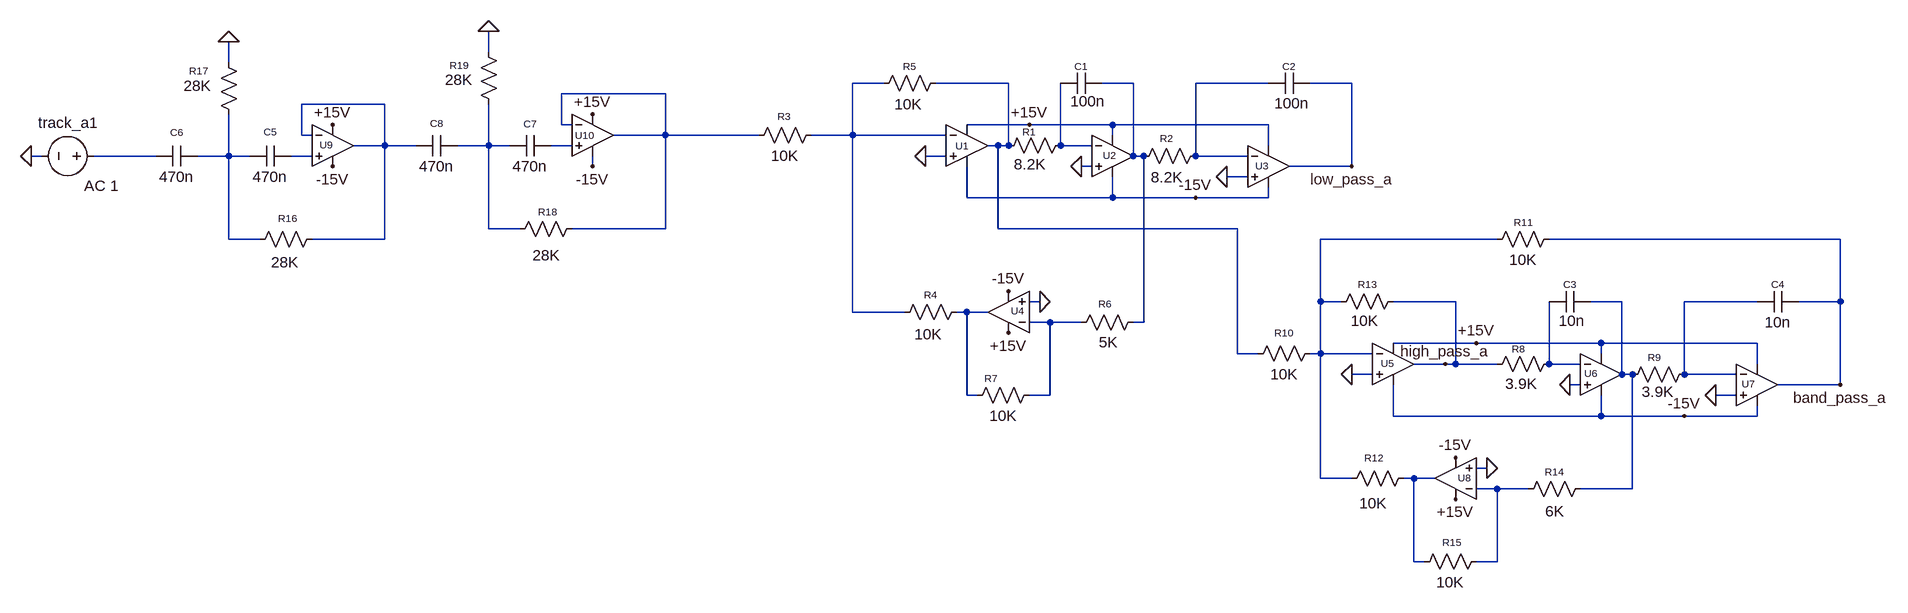
[diagram p0: schematic HighPass_and_SVF.asc]
HighPass_and_SVF.asc, the LTspice schematic file:
Version 4.1
SHEET 1 1408 680
WIRE -768 -240 -768 -272
WIRE -1168 -224 -1168 -256
WIRE -160 -192 -208 -192
WIRE 32 -192 -80 -192
WIRE 224 -192 176 -192
WIRE 432 -192 320 -192
WIRE 560 -192 496 -192
WIRE -496 -176 -656 -176
WIRE -928 -160 -1056 -160
WIRE -656 -128 -656 -176
WIRE -640 -128 -656 -128
WIRE 64 -128 -32 -128
WIRE 192 -128 64 -128
WIRE 432 -128 192 -128
WIRE -1056 -112 -1056 -160
WIRE -1040 -112 -1056 -112
WIRE -496 -112 -496 -176
WIRE -496 -112 -576 -112
WIRE -352 -112 -496 -112
WIRE -208 -112 -208 -192
WIRE -208 -112 -272 -112
WIRE -64 -112 -208 -112
WIRE 192 -112 192 -128
WIRE -928 -96 -928 -160
WIRE -928 -96 -976 -96
WIRE -880 -96 -928 -96
WIRE -768 -96 -768 -160
WIRE -768 -96 -816 -96
WIRE -736 -96 -768 -96
WIRE -640 -96 -672 -96
WIRE 16 -96 0 -96
WIRE 32 -96 32 -192
WIRE 32 -96 16 -96
WIRE 112 -96 112 -192
WIRE 160 -96 112 -96
WIRE 432 -96 432 -128
WIRE -1456 -80 -1472 -80
WIRE -1280 -80 -1376 -80
WIRE -1168 -80 -1168 -144
WIRE -1168 -80 -1216 -80
WIRE -1136 -80 -1168 -80
WIRE -1040 -80 -1072 -80
WIRE -64 -80 -96 -80
WIRE 224 -80 224 -192
WIRE 240 -80 224 -80
WIRE 320 -80 320 -192
WIRE 400 -80 320 -80
WIRE -608 -64 -608 -80
WIRE 160 -64 144 -64
WIRE 560 -64 560 -192
WIRE 560 -64 464 -64
WIRE 400 -48 368 -48
WIRE -32 -16 -32 -64
WIRE 192 -16 192 -48
WIRE 192 -16 -32 -16
WIRE 320 -16 192 -16
WIRE 432 -16 432 -32
WIRE 432 -16 320 -16
WIRE -768 32 -768 -96
WIRE -720 32 -768 32
WIRE -496 32 -496 -112
WIRE -496 32 -640 32
WIRE 16 32 16 -96
WIRE 384 32 16 32
WIRE -1168 48 -1168 -80
WIRE -1120 48 -1168 48
WIRE -928 48 -928 -96
WIRE -928 48 -1040 48
WIRE 784 48 512 48
WIRE 1312 48 864 48
WIRE 80 144 64 144
WIRE 512 144 512 48
WIRE 544 144 512 144
WIRE 720 144 624 144
WIRE 976 144 928 144
WIRE 1184 144 1072 144
WIRE 1312 144 1312 48
WIRE 1312 144 1248 144
WIRE -208 160 -208 -112
WIRE -128 160 -208 160
WIRE -32 160 -48 160
WIRE 0 160 -32 160
WIRE 96 176 64 176
WIRE 144 176 96 176
WIRE 240 176 240 -80
WIRE 240 176 224 176
WIRE 752 208 624 208
WIRE 944 208 752 208
WIRE 1184 208 944 208
WIRE 384 224 384 32
WIRE 416 224 384 224
WIRE 512 224 512 144
WIRE 512 224 496 224
WIRE 592 224 512 224
WIRE 944 224 944 208
WIRE 704 240 656 240
WIRE 720 240 720 144
WIRE 720 240 704 240
WIRE 784 240 720 240
WIRE 864 240 864 144
WIRE 912 240 864 240
WIRE 1184 240 1184 208
WIRE 592 256 560 256
WIRE 976 256 976 144
WIRE 992 256 976 256
WIRE 1072 256 1072 144
WIRE 1152 256 1072 256
WIRE 912 272 896 272
WIRE 1312 272 1312 144
WIRE 1312 272 1216 272
WIRE -32 288 -32 160
WIRE -16 288 -32 288
WIRE 96 288 96 176
WIRE 96 288 64 288
WIRE 1152 288 1120 288
WIRE 624 320 624 272
WIRE 944 320 944 288
WIRE 944 320 624 320
WIRE 1072 320 944 320
WIRE 1184 320 1184 304
WIRE 1184 320 1072 320
WIRE 768 400 752 400
WIRE 512 416 512 224
WIRE 560 416 512 416
WIRE 656 416 640 416
WIRE 688 416 656 416
WIRE 784 432 752 432
WIRE 832 432 784 432
WIRE 992 432 992 256
WIRE 992 432 912 432
WIRE 656 544 656 416
WIRE 672 544 656 544
WIRE 784 544 784 432
WIRE 784 544 752 544
FLAG 144 -64 0
FLAG 368 -48 0
FLAG -96 -80 0
FLAG -1472 -80 0
FLAG 80 144 0
FLAG 64 -128 +15V
FLAG 32 192 +15V
FLAG 320 -16 -15V
FLAG 32 128 -15V
FLAG 896 272 0
FLAG 1120 288 0
FLAG 560 256 0
FLAG 768 400 0
FLAG 752 208 +15V
FLAG 720 448 +15V
FLAG 1072 320 -15V
FLAG 720 384 -15V
FLAG -1168 -256 0
FLAG -1008 -64 -15V
FLAG -1008 -128 +15V
FLAG -768 -272 0
FLAG -608 -64 -15V
FLAG -608 -144 +15V
FLAG 560 -64 low_pass_a
FLAG 1312 272 band_pass_a
FLAG 704 240 high_pass_a
SYMBOL OpAmps\\UniversalOpAmp2 -32 -96 R0
WINDOW 0 -18 0 Left 1
SYMATTR InstName U1
SYMATTR Value2 Avol=200K GBW=10Meg Slew=9Meg
SYMATTR SpiceLine Ilimit=30m Rail=0
SYMBOL OpAmps\\UniversalOpAmp2 192 -80 R0
WINDOW 0 -15 -1 Left 1
SYMATTR InstName U2
SYMATTR Value2 Avol=200K GBW=10Meg Slew=9Meg
SYMATTR SpiceLine Ilimit=30m Rail=0 Vos=0
SYMBOL OpAmps\\UniversalOpAmp2 432 -64 R0
WINDOW 0 -20 -1 Left 1
SYMATTR InstName U3
SYMATTR Value2 Avol=200K GBW=10Meg Slew=9Meg
SYMATTR SpiceLine Ilimit=30m Rail=0 Vos=0
SYMBOL OpAmps\\UniversalOpAmp2 32 160 R180
WINDOW 0 -24 2 Left 1
SYMATTR InstName U4
SYMATTR Value2 Avol=200K GBW=10Meg Slew=9Meg
SYMATTR SpiceLine Ilimit=30m Rail=0 Vos=0
SYMBOL res 128 -112 R90
WINDOW 0 5 64 VBottom 1
WINDOW 3 29 63 VTop 2
SYMATTR InstName R1
SYMATTR Value 8.2K
SYMATTR SpiceLine tol=1
SYMBOL res 336 -96 R90
WINDOW 0 -1 61 VBottom 1
WINDOW 3 33 60 VTop 2
SYMATTR InstName R2
SYMATTR Value 8.2K
SYMATTR SpiceLine tol=1
SYMBOL res -256 -128 R90
WINDOW 0 -3 57 VBottom 1
WINDOW 3 32 56 VTop 2
SYMATTR InstName R3
SYMATTR Value 10K
SYMATTR SpiceLine tol=1
SYMBOL res -32 144 R90
WINDOW 0 0 56 VBottom 1
WINDOW 3 35 59 VTop 2
SYMATTR InstName R4
SYMATTR Value 10K
SYMATTR SpiceLine tol=1
SYMBOL res -64 -208 R90
WINDOW 0 0 56 VBottom 1
WINDOW 3 33 58 VTop 2
SYMATTR InstName R5
SYMATTR Value 10K
SYMATTR SpiceLine tol=1
SYMBOL cap 176 -208 R90
WINDOW 0 0 32 VBottom 1
WINDOW 3 28 22 VTop 2
SYMATTR InstName C1
SYMATTR Value 100n
SYMBOL cap 496 -208 R90
WINDOW 0 0 32 VBottom 1
WINDOW 3 31 28 VTop 2
SYMATTR InstName C2
SYMATTR Value 100n
SYMBOL res 240 160 R90
WINDOW 0 -2 59 VBottom 1
WINDOW 3 31 54 VTop 2
SYMATTR InstName R6
SYMATTR Value 5K
SYMATTR SpiceLine tol=1
SYMBOL res 80 272 R90
WINDOW 0 0 75 VBottom 1
WINDOW 3 32 56 VTop 2
SYMATTR InstName R7
SYMATTR Value 10K
SYMATTR SpiceLine tol=1
SYMBOL voltage -1360 -80 R90
WINDOW 0 -51 8 VRight 2
WINDOW 3 -23 8 VRight 2
WINDOW 123 46 -23 VRight 2
WINDOW 39 0 0 Left 0
SYMATTR InstName track_a1
SYMATTR Value ""
SYMATTR Value2 AC 1
SYMBOL OpAmps\\UniversalOpAmp2 624 240 R0
WINDOW 0 -19 -1 Left 1
SYMATTR InstName U5
SYMATTR Value2 Avol=200K GBW=10Meg Slew=9Meg
SYMATTR SpiceLine Ilimit=30m Rail=0
SYMBOL OpAmps\\UniversalOpAmp2 944 256 R0
WINDOW 0 -26 -2 Left 1
SYMATTR InstName U6
SYMATTR Value2 Avol=200K GBW=10Meg Slew=9Meg
SYMATTR SpiceLine Ilimit=30m Rail=0 Vos=0
SYMBOL OpAmps\\UniversalOpAmp2 1184 272 R0
WINDOW 0 -24 -2 Left 1
SYMATTR InstName U7
SYMATTR Value2 Avol=200K GBW=10Meg Slew=9Meg
SYMATTR SpiceLine Ilimit=30m Rail=0 Vos=0
SYMBOL OpAmps\\UniversalOpAmp2 720 416 R180
WINDOW 0 -24 1 Left 1
SYMATTR InstName U8
SYMATTR Value2 Avol=200K GBW=10Meg Slew=9Meg
SYMATTR SpiceLine Ilimit=30m Rail=0 Vos=0
SYMBOL res 880 224 R90
WINDOW 0 3 63 VBottom 1
WINDOW 3 31 59 VTop 2
SYMATTR InstName R8
SYMATTR Value 3.9K
SYMATTR SpiceLine tol=1
SYMBOL res 1088 240 R90
WINDOW 0 0 62 VBottom 1
WINDOW 3 27 57 VTop 2
SYMATTR InstName R9
SYMATTR Value 3.9K
SYMATTR SpiceLine tol=1
SYMBOL res 512 208 R90
WINDOW 0 -6 56 VBottom 1
WINDOW 3 32 56 VTop 2
SYMATTR InstName R10
SYMATTR Value 10K
SYMATTR SpiceLine tol=1
SYMBOL res 880 32 R90
WINDOW 0 0 56 VBottom 1
WINDOW 3 32 56 VTop 2
SYMATTR InstName R11
SYMATTR Value 10K
SYMATTR SpiceLine tol=1
SYMBOL res 656 400 R90
WINDOW 0 -5 62 VBottom 1
WINDOW 3 39 63 VTop 2
SYMATTR InstName R12
SYMATTR Value 10K
SYMATTR SpiceLine tol=1
SYMBOL res 640 128 R90
WINDOW 0 0 56 VBottom 1
WINDOW 3 30 60 VTop 2
SYMATTR InstName R13
SYMATTR Value 10K
SYMATTR SpiceLine tol=1
SYMBOL cap 928 128 R90
WINDOW 0 0 32 VBottom 1
WINDOW 3 30 29 VTop 2
SYMATTR InstName C3
SYMATTR Value 10n
SYMBOL cap 1248 128 R90
WINDOW 0 0 32 VBottom 1
WINDOW 3 32 32 VTop 2
SYMATTR InstName C4
SYMATTR Value 10n
SYMBOL res 928 416 R90
WINDOW 0 0 56 VBottom 1
WINDOW 3 35 55 VTop 2
SYMATTR InstName R14
SYMATTR Value 6K
SYMATTR SpiceLine tol=1
SYMBOL res 768 528 R90
WINDOW 0 -3 54 VBottom 1
WINDOW 3 32 56 VTop 2
SYMATTR InstName R15
SYMATTR Value 10K
SYMATTR SpiceLine tol=1
SYMBOL OpAmps\\UniversalOpAmp2 -1008 -96 R0
WINDOW 0 -20 -1 Left 1
SYMATTR InstName U9
SYMATTR Value2 Avol=200K GBW=10Meg Slew=9Meg
SYMATTR SpiceLine Ilimit=30m Rail=0
SYMBOL res -1024 32 R90
WINDOW 0 -6 53 VBottom 1
WINDOW 3 36 57 VTop 2
SYMATTR InstName R16
SYMATTR Value 28K
SYMATTR SpiceLine tol=1
SYMBOL res -1184 -240 R0
WINDOW 0 -45 29 Left 1
WINDOW 3 -53 52 Left 2
SYMATTR InstName R17
SYMATTR Value 28K
SYMATTR SpiceLine tol=1
SYMBOL cap -1072 -96 R90
WINDOW 0 -11 32 VBottom 1
WINDOW 3 32 32 VTop 2
SYMATTR InstName C5
SYMATTR Value 470n
SYMBOL cap -1216 -96 R90
WINDOW 0 -10 32 VBottom 1
WINDOW 3 32 32 VTop 2
SYMATTR InstName C6
SYMATTR Value 470n
SYMBOL OpAmps\\UniversalOpAmp2 -608 -112 R0
WINDOW 0 -27 0 Left 1
SYMATTR InstName U10
SYMATTR Value2 Avol=200K GBW=10Meg Slew=9Meg
SYMATTR SpiceLine Ilimit=30m Rail=0
SYMBOL res -624 16 R90
WINDOW 0 0 53 VBottom 1
WINDOW 3 41 55 VTop 2
SYMATTR InstName R18
SYMATTR Value 28K
SYMATTR SpiceLine tol=1
SYMBOL res -784 -256 R0
WINDOW 0 -44 36 Left 1
WINDOW 3 -51 59 Left 2
SYMATTR InstName R19
SYMATTR Value 28K
SYMATTR SpiceLine tol=1
SYMBOL cap -672 -112 R90
WINDOW 0 -7 32 VBottom 1
WINDOW 3 32 32 VTop 2
SYMATTR InstName C7
SYMATTR Value 470n
SYMBOL cap -816 -112 R90
WINDOW 0 -8 32 VBottom 1
WINDOW 3 32 32 VTop 2
SYMATTR InstName C8
SYMATTR Value 470n

The netlist it stands for:
* HighPass_and_SVF.asc
X§U1 0 N001 +15V -15V N002 level2 Avol=200K GBW=10Meg Slew=9Meg Ilimit=30m Rail=0 En=0 Enk=0 In=0 Ink=0 Rin=500Meg  ; pins In+ In- V+ V- OUT
X§U2 0 N009 +15V -15V N003 level2 Avol=200K GBW=10Meg Slew=9Meg Ilimit=30m Rail=0 Vos=0 En=0 Enk=0 In=0 Ink=0 Rin=500Meg  ; pins In+ In- V+ V- OUT
X§U3 0 N004 +15V -15V low_pass_a level2 Avol=200K GBW=10Meg Slew=9Meg Ilimit=30m Rail=0 Vos=0 En=0 Enk=0 In=0 Ink=0 Rin=500Meg  ; pins In+ In- V+ V- OUT
X§U4 0 N017 +15V -15V N016 level2 Avol=200K GBW=10Meg Slew=9Meg Ilimit=30m Rail=0 Vos=0 En=0 Enk=0 In=0 Ink=0 Rin=500Meg  ; pins In+ In- V+ V- OUT
R1 N009 N002 8.2K tol=1
R2 N004 N003 8.2K tol=1
R3 N001 N005 10K tol=1
R4 N016 N001 10K tol=1
R5 N002 N001 10K tol=1
C1 N003 N009 100n
C2 low_pass_a N004 100n
R6 N003 N017 5K tol=1
R7 N017 N016 10K tol=1
V§track_a1 N010 0 AC 1
X§U5 0 N013 +15V -15V high_pass_a level2 Avol=200K GBW=10Meg Slew=9Meg Ilimit=30m Rail=0 En=0 Enk=0 In=0 Ink=0 Rin=500Meg  ; pins In+ In- V+ V- OUT
X§U6 0 N018 +15V -15V N014 level2 Avol=200K GBW=10Meg Slew=9Meg Ilimit=30m Rail=0 Vos=0 En=0 Enk=0 In=0 Ink=0 Rin=500Meg  ; pins In+ In- V+ V- OUT
X§U7 0 N015 +15V -15V band_pass_a level2 Avol=200K GBW=10Meg Slew=9Meg Ilimit=30m Rail=0 Vos=0 En=0 Enk=0 In=0 Ink=0 Rin=500Meg  ; pins In+ In- V+ V- OUT
X§U8 0 N020 +15V -15V N019 level2 Avol=200K GBW=10Meg Slew=9Meg Ilimit=30m Rail=0 Vos=0 En=0 Enk=0 In=0 Ink=0 Rin=500Meg  ; pins In+ In- V+ V- OUT
R8 N018 high_pass_a 3.9K tol=1
R9 N015 N014 3.9K tol=1
R10 N013 N002 10K tol=1
R11 band_pass_a N013 10K tol=1
R12 N019 N013 10K tol=1
R13 high_pass_a N013 10K tol=1
C3 N014 N018 10n
C4 band_pass_a N015 10n
R14 N014 N020 6K tol=1
R15 N020 N019 10K tol=1
X§U9 N012 N006 +15V -15V N006 level2 Avol=200K GBW=10Meg Slew=9Meg Ilimit=30m Rail=0 En=0 Enk=0 In=0 Ink=0 Rin=500Meg  ; pins In+ In- V+ V- OUT
R16 N006 N011 28K tol=1
R17 0 N011 28K tol=1
C5 N012 N011 470n
C6 N011 N010 470n
X§U10 N008 N005 +15V -15V N005 level2 Avol=200K GBW=10Meg Slew=9Meg Ilimit=30m Rail=0 En=0 Enk=0 In=0 Ink=0 Rin=500Meg  ; pins In+ In- V+ V- OUT
R18 N005 N007 28K tol=1
R19 0 N007 28K tol=1
C7 N008 N007 470n
C8 N007 N006 470n
.lib UniversalOpAmp2.lib
.backanno
.end